# EAGLE design design (EAGLE 7.6.0)
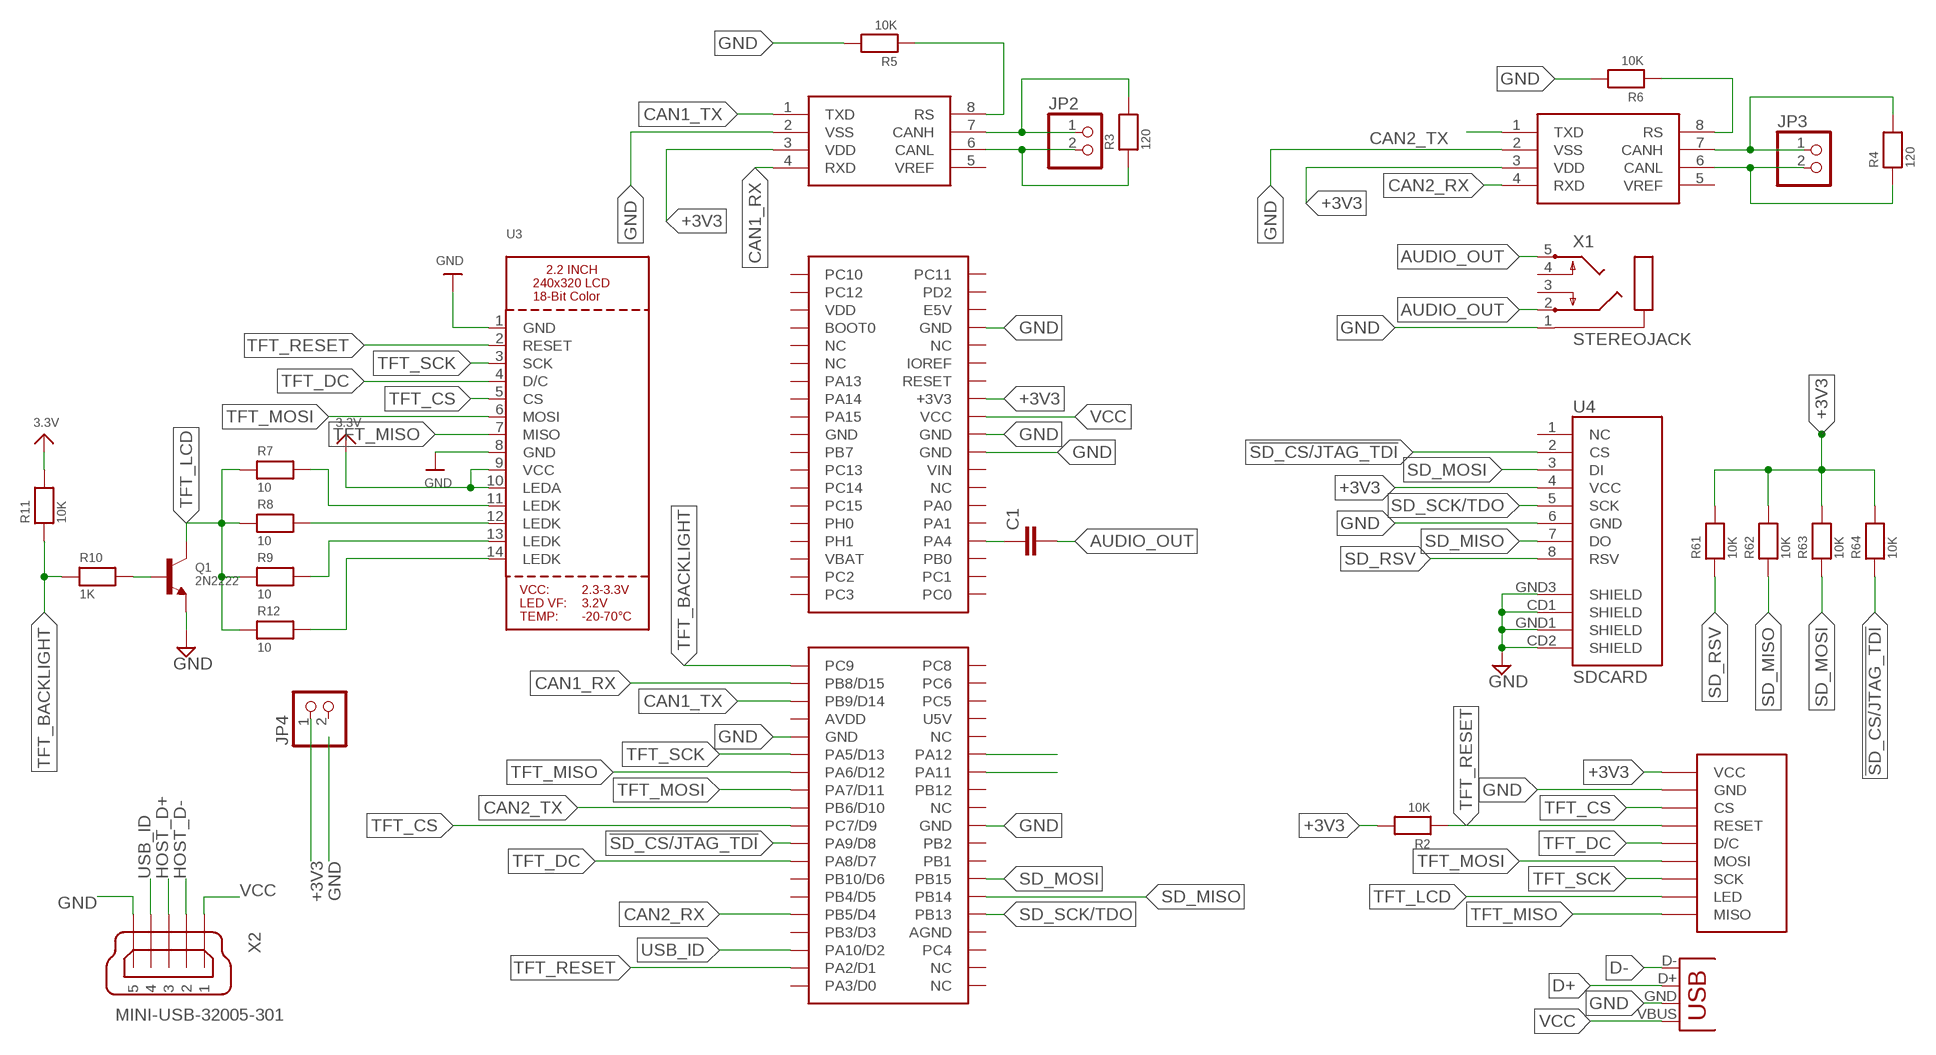
[diagram p0: schematic, sheet 1]

## Parts
C1  CAP1206  [1206]
J1  SPI_TFT_DISPLAY  [SPI_DISPLAY]
JP1  USB-A-H  [USB-A-H]
JP2  HEADER-1X2  [1X02_OVAL]
JP3  HEADER-1X2  [1X02_OVAL]
JP4  HEADER-1X2  [1X02_OVAL]
Q1  2N2222  TRANSISTOR_NPNWIDE  [SOT23-WIDE]
R2  10K  RESISTOR_0805  [_0805]
R3  120  RESISTOR_0805  [_0805]
R4  120  RESISTOR_0805  [_0805]
R5  10K  RESISTOR_0805  [_0805]
R6  10K  RESISTOR_0805  [_0805]
R7  10  RESISTOR_0805  [_0805]
R8  10  RESISTOR_0805  [_0805]
R9  10  RESISTOR_0805  [_0805]
R10  1K  RESISTOR_0805  [_0805]
R11  10K  RESISTOR_0805  [_0805]
R12  10  RESISTOR_0805  [_0805]
R61  10K  RESISTOR_0805  [_0805]
R62  10K  RESISTOR_0805  [_0805]
R63  10K  RESISTOR_0805  [_0805]
R64  10K  RESISTOR_0805  [_0805]
U1  SN65HVD235DR  MCP2551  [SO08]
U2  SN65HVD235DR  MCP2551  [SO08]
U3  DISP_LCD_TM022HDH26  [TM022HDH26_2.2IN_LCD]
U4  SDCARD  USD-SOCKETNEW  [MICRO-SD-SOCKET-PP]
U$1  MOPHOMOPHO_466RE  [MOPHO]
X1  STEREOJACK  [STX3100]
X2  MINI-USB-32005-301  [32005-301]

## Nets
3.3V: R11.2
!SD_CS/JTAG_TDI: R64.1 U4.2(CS) U$1.P$59(PA9/D8)
+3V3: J1.VCC JP4.1 R2.2 R61.2 R62.2 R63.2 R64.2 U1.3(VDD) U2.3(VDD) U3.9(VCC) U3.10(LEDA) U4.4(VCC) U$1.P$16(+3V3) ; supply symbol labelled 3.3V
AUDIO_OUT: C1.2 X1.2 X1.5
CAN1_RX: U2.4(RXD) U$1.P$41(PB8/D15)
CAN1_TX: U2.1(TXD) U$1.P$43(PB9/D14)
CAN2_RX: U1.4(RXD) U$1.P$67(PB5/D4)
CAN2_TX: U1.1(TXD) U$1.P$55(PB6/D10)
CANH1: JP2.1 R3.2 U2.7(CANH)
CANH2: JP3.1 R4.2 U1.7(CANH)
CANL1: JP2.2 R3.1 U2.6(CANL)
CANL2: JP3.2 R4.1 U1.6(CANL)
D+: JP1.D+(D-) U$1.P$50(PA12)
D-: JP1.D-(D+) U$1.P$52(PA11)
GND: J1.GND JP1.GND(VBUS) Q1.2(E) R5.2 R6.2 U1.2(VSS) U2.2(VSS) U3.1(GND) U3.8(GND) U4.6(GND) U4.CD1(SHIELD) U4.CD2(SHIELD) U4.GND1(SHIELD) U4.GND3(SHIELD) U$1.P$8(GND) U$1.P$20(GND) U$1.P$22(GND) U$1.P$47(GND) U$1.P$58(GND) X1.1 X2.5
HOST_D+: X2.3
HOST_D-: X2.2
N$1: C1.1 U$1.P$32(PA4)
N$11: R6.1 U1.8(RS)
N$12: R5.1 U2.8(RS)
N$13: R7.2 U3.11(LEDK)
N$14: R8.2 U3.12(LEDK)
N$15: R9.2 U3.13(LEDK)
N$16: Q1.1(B) R10.2
N$17: R12.2 U3.14(LEDK)
SD_MISO: R62.1 U4.7(DO) U$1.P$66(PB14)
SD_MOSI: R63.1 U4.3(DI) U$1.P$64(PB15)
SD_RSV: R61.1 U4.8(RSV)
SD_SCK/TDO: U4.5(SCK) U$1.P$68(PB13)
TFT_BACKLIGHT: R10.1 R11.1 U$1.P$39(PC9)
TFT_CS: J1.CS U3.5(CS) U$1.P$57(PC7/D9)
TFT_DC: J1.D/C U3.4(D/C) U$1.P$61(PA8/D7)
TFT_LCD: J1.LED Q1.3(C) R7.1 R8.1 R9.1 R12.1
TFT_MISO: J1.MISO U3.7(MISO) U$1.P$51(PA6/D12)
TFT_MOSI: J1.MOSI U3.6(MOSI) U$1.P$53(PA7/D11)
TFT_RESET: J1.RESET R2.1 U3.2(RESET) U$1.P$73(PA2/D1)
TFT_SCK: J1.SCK U3.3(SCK) U$1.P$49(PA5/D13)
USB_ID: U$1.P$71(PA10/D2) X2.4
VCC: JP1.VBUS(GND) U$1.P$18(VCC) X2.1
Unconnected: JP4.2 U1.5(VREF) U2.5(VREF) U4.1(NC) U$1.P$1(PC10) U$1.P$2(PC11) U$1.P$3(PC12) U$1.P$4(PD2) U$1.P$6(E5V) U$1.P$7(BOOT0) U$1.P$9(NC) U$1.P$10(NC) U$1.P$11(NC) U$1.P$12(IOREF) U$1.P$13(PA13) U$1.P$14(RESET) U$1.P$15(PA14) U$1.P$17(PA15) U$1.P$19(GND) U$1.P$21(PB7) U$1.P$23(PC13) U$1.P$25(PC14) U$1.P$26(NC) U$1.P$27(PC15) U$1.P$28(PA0) U$1.P$29(PH0) U$1.P$30(PA1) U$1.P$31(PH1) U$1.P$34(PB0) U$1.P$35(PC2) U$1.P$36(PC1) U$1.P$37(PC3) U$1.P$38(PC0) U$1.P$40(PC8) U$1.P$42(PC6) U$1.P$44(PC5) U$1.P$46(U5V) U$1.P$48(NC) U$1.P$54(PB12) U$1.P$56(NC) U$1.P$60(PB2) U$1.P$62(PB1) U$1.P$63(PB10/D6) U$1.P$65(PB4/D5) U$1.P$69(PB3/D3) U$1.P$70(AGND) U$1.P$72(PC4) U$1.P$74(NC) U$1.P$75(PA3/D0) U$1.P$76(NC) X1.3 X1.4

## Power pins joined to a net without a drawn wire
AVDD: U$1.P$45(AVDD)
VBAT: U$1.P$33(VBAT)
VDD: U$1.P$5(VDD)
VIN: U$1.P$24(VIN)

## Library data of the parts
C1 = SparkFun:CAP: Capacitor Standard 0603 ceramic capacitor, and 0.1" leaded capacitor.
J1 = kanflo:SPI_TFT_DISPLAY: SPI TFT Display Connector for the cheap 2.2"/2.4" Serial SPI TFT displays found on eBay.
JP1 = SparkFun-Connectors:USB: USB Connectors USB-B-PTH is fully proven SKU : PRT-00139/CONN-08278 USB-miniB is fully proven SKU : PRT-00587 USB-A-PCB is untested. USB-A-H is throughly reviewed, but untested. Spark Fun Electronics SKU : PRT-00437 USB-B-SMT is throughly reviewed, but untested. Needs silkscreen touching up. USB-A-S has not been used/tested USB-MB-H has not been used/tested USB-MICROB has been used. CONN-09505
JP2-JP4 = microbuilder:HEADER-1X2: PIN HEADER
Q1 = microbuilder:TRANSISTOR_NPN: NPN Transistor Transistor (NPN) 500mA 45V - BC817 [Digikey: 568-1631-1-ND] Transistor (NPN) 500mA 45V - BC817,215 [Mouser: 771-BC817-T/R] SOT23-R - SOT23 footprint optimised for use with solder paste and reflow ovens. SOT23-W - SOT23 footprint optimised for hand-soldering (larger pads).
R2-R6 R61-R64 = microbuilder:RESISTOR: Resistors 0402 - 0402 Surface Mount Package 22 Ohm 1% 1/16W [Digikey: 311-22.0LRTR-ND] 33 Ohm 5% 1/16W 1.0K 5% 1/16W 1.5K 5% 1/16W 2.0K 1% 1/16W 10.0K 1% 1/16W [Digikey: 311-10.0KLRTR-ND] 10.0K 5% 1/16W [Digikey: RMCF0402JT10K0TR-ND] 12.1K 1% 1/16W [Digikey: 311-22.0LRTR-ND] 100.0K 5% 1/16W 0603 - 0603 Surface Mount Package 0 Ohm 1/10 Watt 1% Resistor 15 Ohm 1/10 Watt 1% Resistor 33 Ohm 1/10 Watt 1% Resistor 49.9 Ohm 1/10 Watt 1% Resistor 100 Ohm 1/10 Watt 1% Resistor 150 Ohm 1/10 Watt 1% Resistor 240 Ohm 1/10 Watt 1% Resistor 390 Ohm 1/10 Watt 1% Resistor 560 Ohm 1/10 Watt 1% Resistor 680 Ohm 1/10 Watt 1% Resistor 750 Ohm 1/10 Watt 1% Resistor 1.0K Ohm 1/10 Watt 1% Resistor 1.5K Ohm 1/10 Watt 1% Resistor 2.0K Ohm 1/10 Watt 1% Resistor 2.2K Ohm 1/10 Watt 1% Resistor 3.3K Ohm 1/10 Watt 1% Resistor 4.7K Ohm 1/10 Watt 1% Resistor 10.0K Ohm 1/10 Watt 1% Resistor 12.0K Ohm 1/10 Watt 1% Resistor 12.1K Ohm 1/10 Watt 1% Resistor 20.0K Ohm 1/10 Watt 1% Resistor 33.0K Ohm 1/10 Watt 1% Resistor 100.0K Ohm 1/10 Watt 1% Resistor 0805 - 0805 Surface Mount Package 0 Ohm 1/8 Watt 1% Resistor 33 Ohm 1/8 Watt 1% Resistor 100 Ohm 1/8 Watt 1% Resistor 150 Ohm 1/8 Watt 1% Resistor 200 Ohm 1/8 Watt 1% Resistor 240 Ohm 1/8 Watt 1% Resistor 330 Ohm 1/8 Watt 1% Resistor 390 Ohm 1/8 Watt 1% Resistor 470 Ohm 1/8 Watt 1% Resistor 1.0K Ohm 1/8 Watt 1% Resistor 1.5K Ohm 1/8 Watt 1% Resistor 2.0K Ohm 1/8 Watt 1% Resistor 4.7K Ohm 1/8 Watt 1% Resistor 5.1K Ohm 1/8 Watt 1% Resistor 5.6K Ohm 1/8 Watt 1% Resistor 10.0K Ohm 1/8 Watt 1% Resistor 22.0K Ohm 1/8 Watt 1% Resistor 33.0K Ohm 1/8 Watt 1% Resistor 100K Ohm 1/8 Watt 1% Resistor 1206 - 1206 Surface Mount Package 2012 - 2010 Surface Mount Package 0.11 Ohm 1/2 Watt 1% Resistor - Digikey: RHM.11UCT-ND; DIGIKEY: RMCF0603JT10K0CT-ND; MPN: RMCF0603JT10K0; OC_NEWARK: unknown; PARTNO: RMCF0603JT10K0
R7-R12 = microbuilder:RESISTOR: Resistors 0402 - 0402 Surface Mount Package 22 Ohm 1% 1/16W [Digikey: 311-22.0LRTR-ND] 33 Ohm 5% 1/16W 1.0K 5% 1/16W 1.5K 5% 1/16W 2.0K 1% 1/16W 10.0K 1% 1/16W [Digikey: 311-10.0KLRTR-ND] 10.0K 5% 1/16W [Digikey: RMCF0402JT10K0TR-ND] 12.1K 1% 1/16W [Digikey: 311-22.0LRTR-ND] 100.0K 5% 1/16W 0603 - 0603 Surface Mount Package 0 Ohm 1/10 Watt 1% Resistor 15 Ohm 1/10 Watt 1% Resistor 33 Ohm 1/10 Watt 1% Resistor 49.9 Ohm 1/10 Watt 1% Resistor 100 Ohm 1/10 Watt 1% Resistor 150 Ohm 1/10 Watt 1% Resistor 240 Ohm 1/10 Watt 1% Resistor 390 Ohm 1/10 Watt 1% Resistor 560 Ohm 1/10 Watt 1% Resistor 680 Ohm 1/10 Watt 1% Resistor 750 Ohm 1/10 Watt 1% Resistor 1.0K Ohm 1/10 Watt 1% Resistor 1.5K Ohm 1/10 Watt 1% Resistor 2.0K Ohm 1/10 Watt 1% Resistor 2.2K Ohm 1/10 Watt 1% Resistor 3.3K Ohm 1/10 Watt 1% Resistor 4.7K Ohm 1/10 Watt 1% Resistor 10.0K Ohm 1/10 Watt 1% Resistor 12.0K Ohm 1/10 Watt 1% Resistor 12.1K Ohm 1/10 Watt 1% Resistor 20.0K Ohm 1/10 Watt 1% Resistor 33.0K Ohm 1/10 Watt 1% Resistor 100.0K Ohm 1/10 Watt 1% Resistor 0805 - 0805 Surface Mount Package 0 Ohm 1/8 Watt 1% Resistor 33 Ohm 1/8 Watt 1% Resistor 100 Ohm 1/8 Watt 1% Resistor 150 Ohm 1/8 Watt 1% Resistor 200 Ohm 1/8 Watt 1% Resistor 240 Ohm 1/8 Watt 1% Resistor 330 Ohm 1/8 Watt 1% Resistor 390 Ohm 1/8 Watt 1% Resistor 470 Ohm 1/8 Watt 1% Resistor 1.0K Ohm 1/8 Watt 1% Resistor 1.5K Ohm 1/8 Watt 1% Resistor 2.0K Ohm 1/8 Watt 1% Resistor 4.7K Ohm 1/8 Watt 1% Resistor 5.1K Ohm 1/8 Watt 1% Resistor 5.6K Ohm 1/8 Watt 1% Resistor 10.0K Ohm 1/8 Watt 1% Resistor 22.0K Ohm 1/8 Watt 1% Resistor 33.0K Ohm 1/8 Watt 1% Resistor 100K Ohm 1/8 Watt 1% Resistor 1206 - 1206 Surface Mount Package 2012 - 2010 Surface Mount Package 0.11 Ohm 1/2 Watt 1% Resistor - Digikey: RHM.11UCT-ND
U1 U2 = SparkFun:MCP2551
U3 = microbuilder:DISP_LCD_TM022HDH26: TM022HDH26 2.2 Inch 240x320 18-bit LCD - ILI9340C Controller
U4 = STM32-PROX:USD-SOCKET: microSD Socket Push-push type uSD socket. Schematic element and footprint production proven. Spark Fun Electronics SKU : PRT-00127. tDoc lines correctly indicate media card edge positions when inserting (unlocked, locked, depressed).; OC_NEWARK: unknown; PARTNO: *
U$1 = mopho:MOPHO
X1 = adafruit:STEREOJACK: MIC/HEADPHONE JACK Stereo jack with two switches. Kycon STX3100, CUI SJ1-3555NG and/or 4UCon 05544
X2 = con-cypressindustries:MINI-USB-: MINI USB-B Conector Source: www.cypressindustries.com; OC_FARNELL: unknown; OC_NEWARK: unknown

## Net classes
0 default: width 0.254 mm
2 power: width 0.305 mm, drill 0.254 mm

## Board
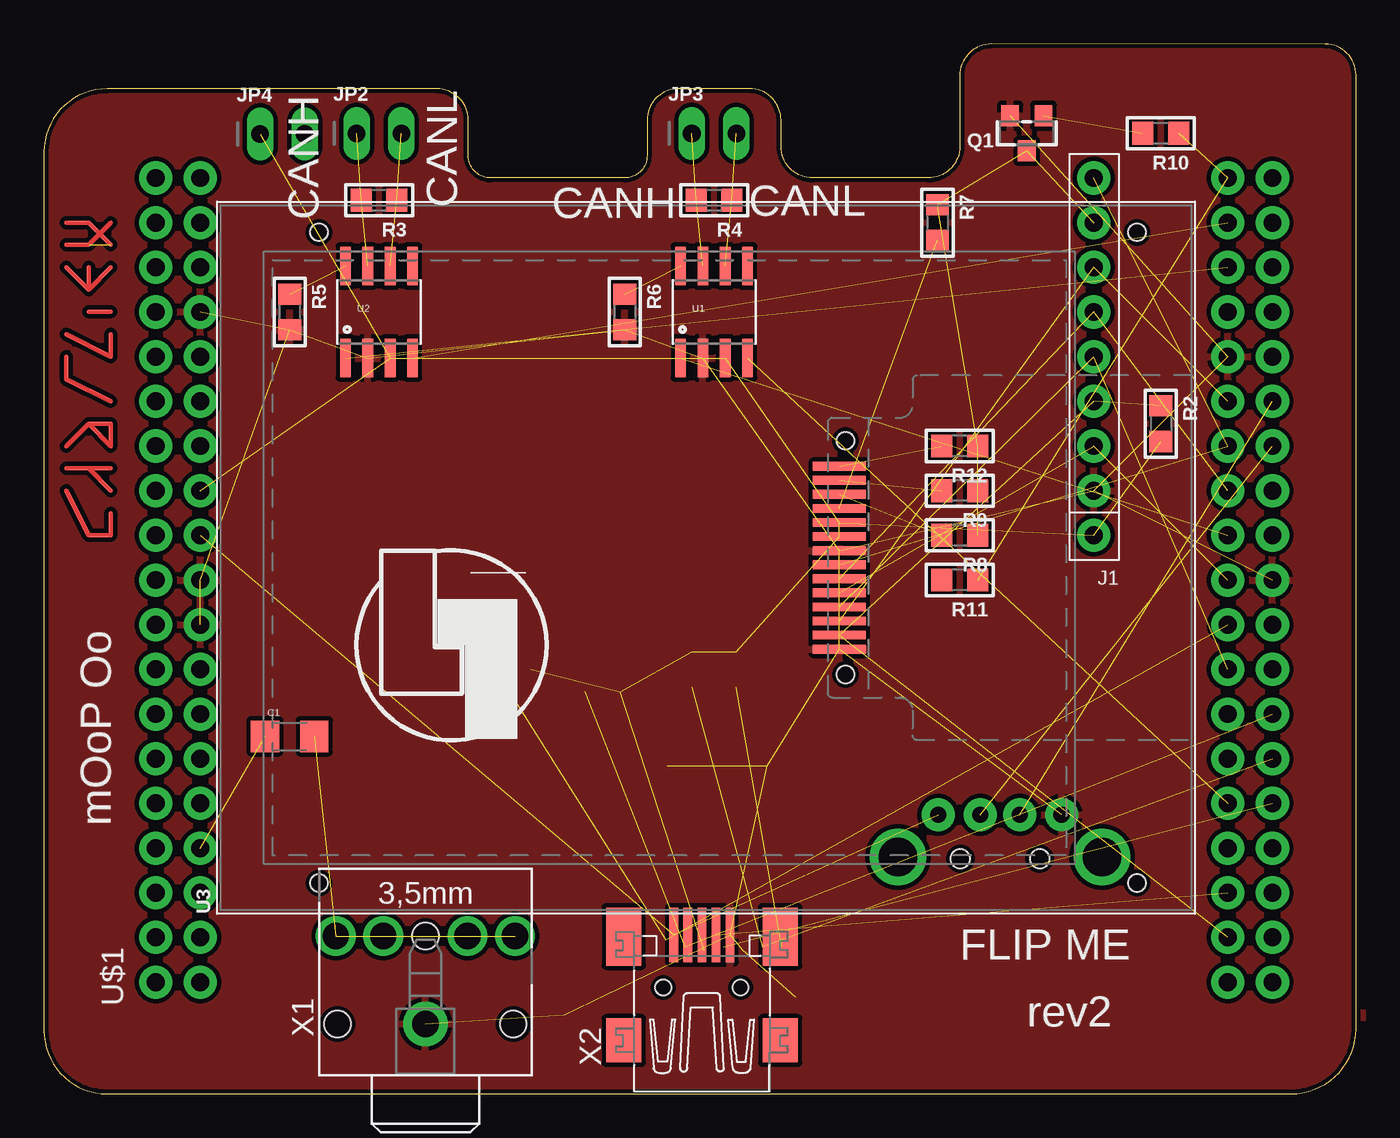
[diagram p1: board, top side]
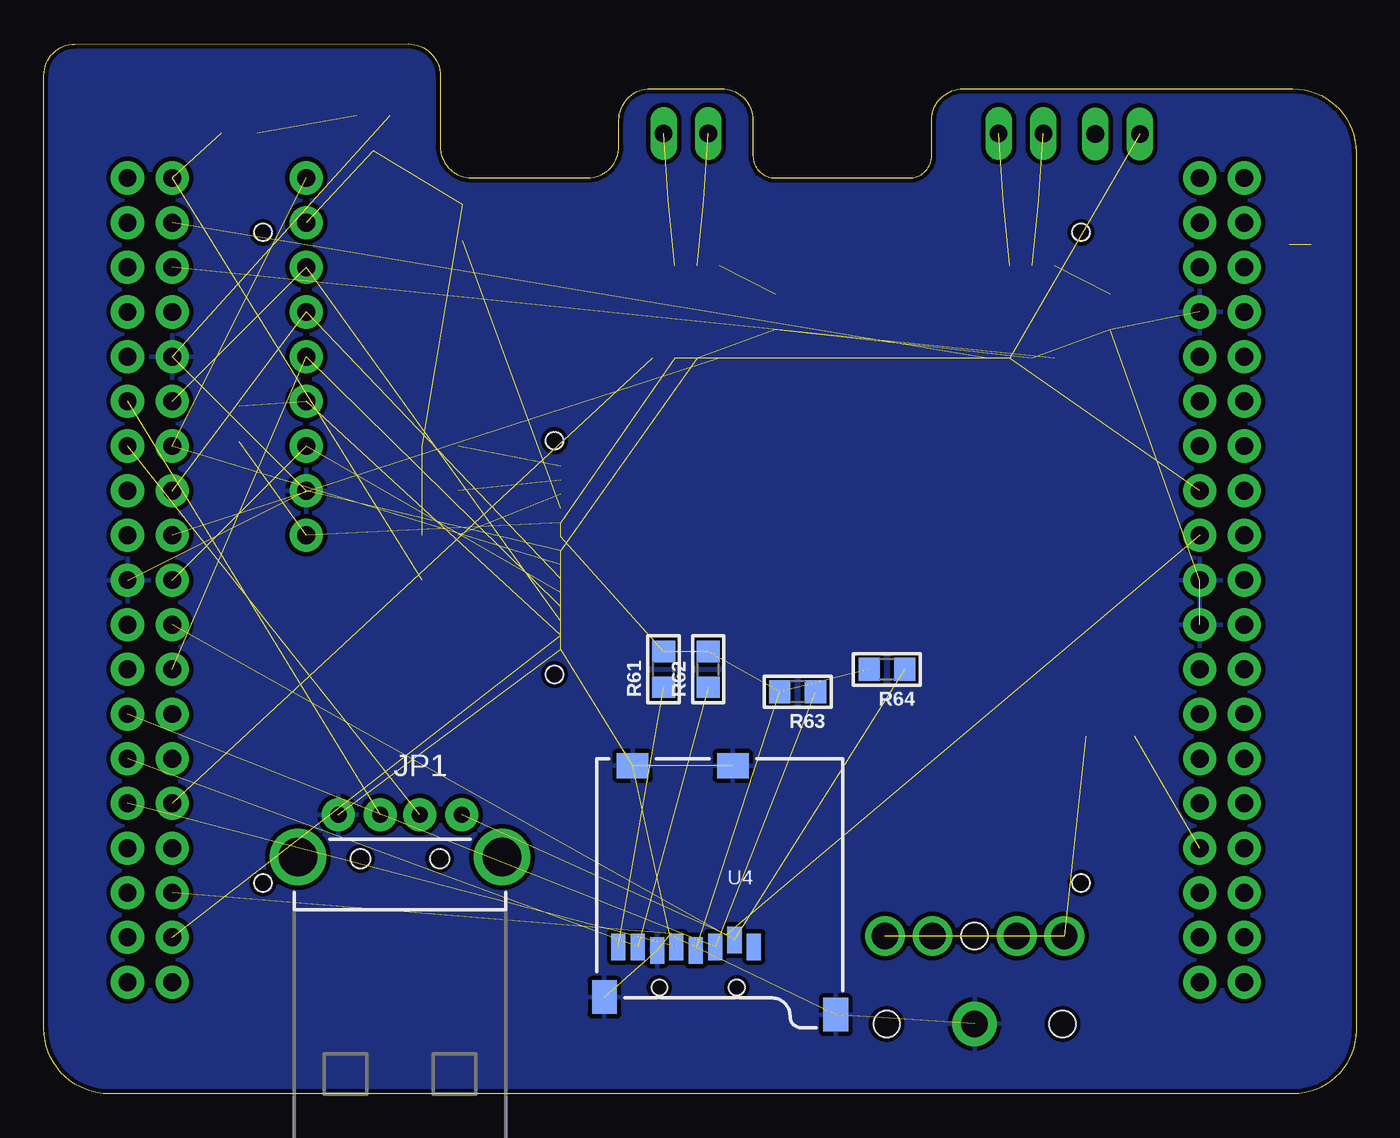
[diagram p2: board, bottom side, seen from below]

Size 74.6 x 59.69 mm. Coordinates in mm from the lower left corner, seen from the top.
Outline: 22.34,57.14 3.58,57.14 arc90 0,53.55 0,3.59 arc90 3.59,0 70.9,0 arc90 74.6,3.7 74.6,57.92 arc90 72.84,59.68 53.87,59.69 arc90 52.07,57.89 52.07,53.87 arc-90 50.27,52.07 43.71,52.07 arc-90 41.91,53.87 41.91,55.35 arc90 40.11,57.15 36.09,57.15 arc90 34.29,55.35 34.29,53.34 arc-90 33.02,52.07 25.4,52.07 arc-90 24.13,53.34 24.13,55.35 arc90 22.34,57.14
Copper layers (1*16): Top 0.035mm / dielectric 1.5mm / Bottom 0.035mm
Design rules "ITEADstudio_DRC": minimum track width 6mil, minimum drill 12mil, track to track 6mil, track to pad 6mil, pad to pad 6mil, via to via 6mil, smd to smd 0mil, copper to edge 10mil, drill to drill 10mil, minimum pad ring 10mil, minimum via ring 6mil, stop-mask expansion 2mil, vias tented up to drill 100mil, thermal gap 10mil

### Footprints (pad centres in the part's own frame; a part is rotated, then mirrored left to right if it is on the bottom)
1206 = smd 1.6 x 1.8: 1 -1.4,0; 2 1.4,0
SPI_DISPLAY = drill 1.016 pad 1.88: CS -5.08,3.81; D/C -5.08,-1.27; GND -5.08,6.35; LED -5.08,-8.89; MISO -5.08,-11.43; MOSI -5.08,-3.81; RESET -5.08,1.27; SCK -5.08,-6.35; VCC -5.08,8.89
USB-A-H = drill 0.914 pad 1.88: D+ 2.4,1.127; D- 2.4,-1.127; GND 2.4,3.5; VBUS 2.4,-3.5 | drill 2.2: GND2 0,-5.8; GND3 0,5.8 | hole 1.1: -0.1,2.25; -0.1,-2.25
1X02_OVAL = drill 1 long: 1 -1.27,0; 2 1.27,0
SOT23-WIDE = smd 1 x 1.2: 1 -0.95,-1; 2 0.95,-1; 3 0,1
_0805 = smd 1.2 x 1.3: 1 -1.016,0; 2 1.016,0
SO08 = smd 0.61 x 2.21: 1 -1.905,-2.616; 2 -0.635,-2.616; 3 0.635,-2.616; 4 1.905,-2.616; 5 1.905,2.616; 6 0.635,2.616; 7 -0.635,2.616; 8 -1.905,2.616
TM022HDH26_2.2IN_LCD = smd 0.5 x 3: 1 -5.2,-9.66; 2 -4.4,-9.66; 3 -3.6,-9.66; 4 -2.8,-9.66; 5 -2,-9.66; 6 -1.2,-9.66; 7 -0.4,-9.66; 8 0.4,-9.66; 9 1.2,-9.66; 10 2,-9.66; 11 2.8,-9.66; 12 3.6,-9.66; 13 4.4,-9.66; 14 5.2,-9.66 | hole 1: -6.65,-10.01; 6.65,-10.01; 18.5,19.92; -18.5,19.92; -18.5,-26.58; 18.5,-26.58
MICRO-SD-SOCKET-PP = smd 0.8 x 1.5: 1 -8.94,10.7; 2 -7.84,10.3; 3 -6.74,10.7; 4 -5.64,10.9; 5 -4.54,10.7; 6 -3.44,10.9; 7 -2.34,10.7; 8 -1.24,10.7 | smd 1.8 x 1.4: CD1 -2.05,0.4; CD2 -7.75,0.4 | smd 1.4 x 1.9: GND1 -13.6,14.55; GND3 -0.45,13.55
MOPHO = drill 1.016 pad 1.88: P$1 2.54,48.26; P$2 5.08,48.26; P$3 2.54,45.72; P$4 5.08,45.72; P$5 2.54,43.18; P$6 5.08,43.18; P$7 2.54,40.64; P$8 5.08,40.64; P$9 2.54,38.1; P$10 5.08,38.1; P$11 2.54,35.56; P$12 5.08,35.56; P$13 2.54,33.02; P$14 5.08,33.02; P$15 2.54,30.48; P$16 5.08,30.48; P$17 2.54,27.94; P$18 5.08,27.94; P$19 2.54,25.4; P$20 5.08,25.4; P$21 2.54,22.86; P$22 5.08,22.86; P$23 2.54,20.32; P$24 5.08,20.32; P$25 2.54,17.78; P$26 5.08,17.78; P$27 2.54,15.24; P$28 5.08,15.24; P$29 2.54,12.7; P$30 5.08,12.7; P$31 2.54,10.16; P$32 5.08,10.16; P$33 2.54,7.62; P$34 5.08,7.62; P$35 2.54,5.08; P$36 5.08,5.08; P$37 2.54,2.54; P$38 5.08,2.54; P$39 63.5,48.26; P$40 66.04,48.26; P$41 63.5,45.72; P$42 66.04,45.72; P$43 63.5,43.18; P$44 66.04,43.18; P$45 63.5,40.64; P$46 66.04,40.64; P$47 63.5,38.1; P$48 66.04,38.1; P$49 63.5,35.56; P$50 66.04,35.56; P$51 63.5,33.02; P$52 66.04,33.02; P$53 63.5,30.48; P$54 66.04,30.48; P$55 63.5,27.94; P$56 66.04,27.94; P$57 63.5,25.4; P$58 66.04,25.4; P$59 63.5,22.86; P$60 66.04,22.86; P$61 63.5,20.32; P$62 66.04,20.32; P$63 63.5,17.78; P$64 66.04,17.78; P$65 63.5,15.24; P$66 66.04,15.24; P$67 63.5,12.7; P$68 66.04,12.7; P$69 63.5,10.16; P$70 66.04,10.16; P$71 63.5,7.62; P$72 66.04,7.62; P$73 63.5,5.08; P$74 66.04,5.08; P$75 63.5,2.54; P$76 66.04,2.54
STX3100 = drill 1.5 pad 2.54: 1 2.7,-0.1 | drill 1.5: 2 7.7,5; 3 7.7,2.3; 4 7.7,-2.5; 5 7.7,-5.2 | hole 1.5: 2.7,4.9; 2.7,-5.1; 7.7,-0.1
32005-301 = smd 3.1 x 0.5: 1 3,1.6; 2 3,0.8; 3 3,0; 4 3,-0.8; 5 3,-1.6 | smd 2.5 x 2: M1 -3,-4.45; M2 -3,4.45 | smd 3.3 x 2: M3 2.9,4.45; M4 2.9,-4.45 | hole 0.9: 0,2.2; 0,-2.2

### Placement (x,y rotation side)
C1  13.97,20.32 0 top
J1  54.61,40.64 180 top
JP1  54.36,13.46 90 bottom
JP2  19.05,54.61 0 top
JP3  38.1,54.61 0 top
JP4  13.56,54.56 0 top
Q1  55.88,54.61 180 top
R2  63.5,38.1 270 top
R3  19.05,50.8 180 top
R4  38.1,50.8 180 top
R5  13.97,44.45 270 top
R6  33.02,44.45 270 top
R7  50.8,49.53 270 top
R8  52.07,31.75 180 top
R9  52.07,34.29 180 top
R10  63.5,54.61 180 top
R11  52.07,29.21 180 top
R12  52.07,36.83 180 top
R61  39.37,24.13 90 bottom
R62  36.83,24.13 90 bottom
R63  31.75,22.86 180 bottom
R64  26.67,24.13 180 bottom
U1  38.1,44.45 0 top
U2  19.05,44.45 0 top
U3  35.56,30.48 90 top
U4  43.18,19.05 180 bottom
U$1  3.81,3.81 0 top
X1  21.59,1.27 90 top
X2  37.41,6.04 90 top

### Tracks (layer width: path | path; a pad name or v marks a point on that pad's centre or on a via)
!SD_CS/JTAG_TDI  (2 unrouted)
+3V3  (12 unrouted)
AUDIO_OUT  (2 unrouted)
CAN1_RX  (1 unrouted)
CAN1_TX  (1 unrouted)
CAN2_RX  (1 unrouted)
CAN2_TX  (1 unrouted)
CANH1  (2 unrouted)
CANH2  (2 unrouted)
CANL1  (2 unrouted)
CANL2  (2 unrouted)
D+  (1 unrouted)
D-  (1 unrouted)
GND  (20 unrouted)
  pour Top (isolate 0.254): 0,53.56 0,4.34 arc90 3.07,0 71.12,0 arc90 74.93,5.08 74.93,58.42 arc90 72.39,59.69 53.87,59.69 arc90 52.07,56.62 52.07,53.87 arc-90 50.27,52.07 43.18,52.07 arc-90 41.91,53.34 41.91,55.35 arc90 40.11,57.15 36.09,57.15 arc90 34.29,55.35 34.29,53.34 arc-90 33.02,52.07 25.4,52.07 arc-90 24.13,53.34 24.13,55.35 arc90 22.33,57.15 4.86,57.15 arc90
  pour Bottom (isolate 0.254): 2.84,0 72.39,0 arc90 74.93,2.54 74.93,57.89 arc90 73.13,59.69 53.34,59.69 arc90 52.07,58.42 52.07,53.87 arc-90 50.27,52.07 43.18,52.07 arc-90 41.91,53.34 41.91,55.88 arc90 40.64,57.15 36.09,57.15 arc90 34.29,55.35 34.29,52.07 25.4,52.07 arc-90 24.13,53.34 24.13,55.35 arc90 22.33,57.15 4.58,57.15 arc90 0,52.57 0,2.84 arc90
N$1  (1 unrouted)
N$2
  Top 0.254: 1.27,35.56 2.54,35.56 | 3.81,34.29 2.54,35.56 | 2.54,35.56 3.81,35.56
N$3
  Top 0.254: 2.54,38.1 3.81,38.1 3.81,36.83 2.54,38.1 | 2.54,38.1 1.27,36.83
N$4
  Top 0.254: 1.27,34.29 2.54,31.75 3.81,31.75 3.81,33.02
N$5
  Top 0.254: 3.81,39.37 1.27,40.64 1.27,41.91
N$6
  Top 0.254: 1.27,43.18 3.81,41.91 3.81,43.18
N$7
  Top 0.254: 2.54,44.45 3.81,44.45
N$9
  Top 0.254: 2.54,45.72 3.81,46.99 | 2.54,45.72 1.27,46.99 | 2.54,45.72 2.54,46.99
N$10  (1 unrouted)
  Top 0.254: 1.27,48.26 2.54,48.26 3.81,49.53 | 3.81,48.26 2.54,49.53 1.27,49.53
N$11  (1 unrouted)
N$12  (1 unrouted)
N$13  (1 unrouted)
N$14  (1 unrouted)
N$15  (1 unrouted)
N$16  (1 unrouted)
N$17  (1 unrouted)
SD_MISO  (2 unrouted)
SD_MOSI  (2 unrouted)
SD_RSV  (1 unrouted)
SD_SCK/TDO  (1 unrouted)
TFT_BACKLIGHT  (2 unrouted)
TFT_CS  (2 unrouted)
TFT_DC  (2 unrouted)
TFT_LCD  (5 unrouted)
TFT_MISO  (2 unrouted)
TFT_MOSI  (2 unrouted)
TFT_RESET  (3 unrouted)
TFT_SCK  (2 unrouted)
USB_ID  (1 unrouted)
VCC  (2 unrouted)

### Text on the board
tPlace: CANH | CANH | CANL | CANL | mOoP Oo
_tsilk: FLIP ME | rev2